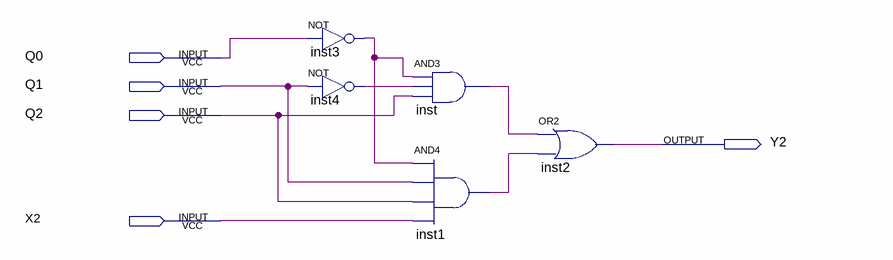
[diagram p0: schematic sheet]
// Quartus schematic Y2.bdf as structural Verilog: 5 symbols, 5 pins
module Y2 (
  input  Q0,
  input  Q1,
  input  Q2,
  input  X2,
  output Y2
);

  wire inst1_out, inst3_out, inst4_out, inst_out;

  not inst3 (inst3_out, Q0);
  not inst4 (inst4_out, Q1);
  and inst (inst_out, inst3_out, inst4_out, Q2);
  and inst1 (inst1_out, inst3_out, Q1, Q2, X2);
  or inst2 (Y2, inst_out, inst1_out);
endmodule
